# Altium schematic sheet Sheet1.SchDoc
size A3
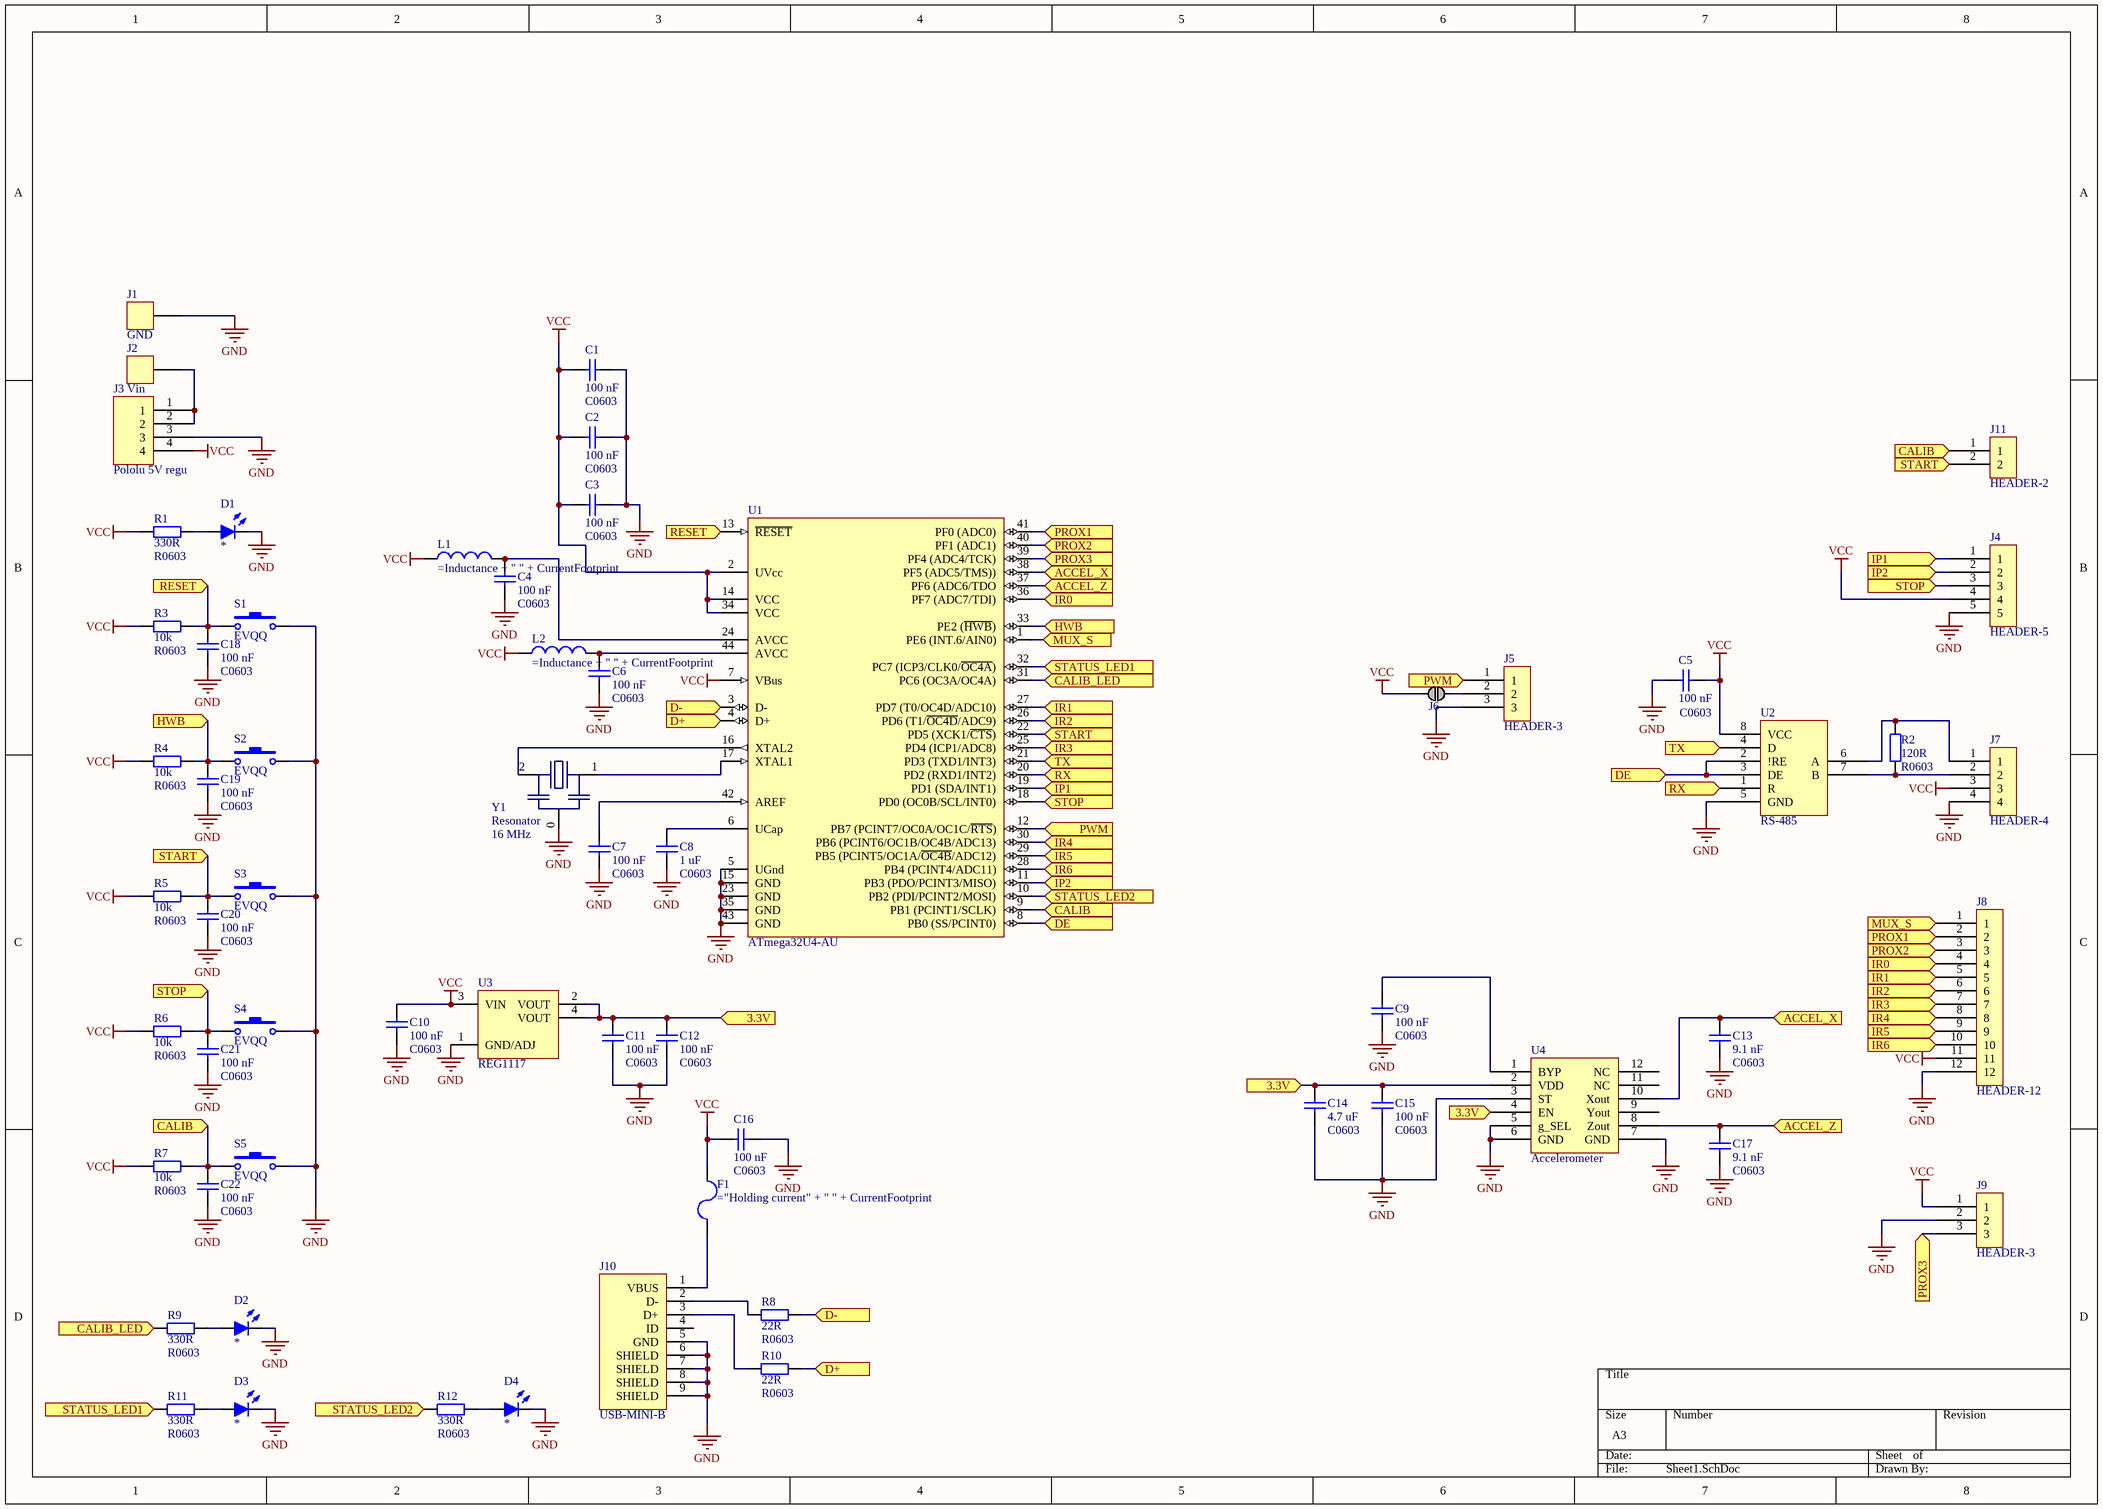
[diagram p0: Sheet1.SchDoc]

## Parts
C1  Capacitance: 100 nF  [C0603]
C2  Capacitance: 100 nF  [C0603]
C3  Capacitance: 100 nF  [C0603]
C4  Capacitance: 100 nF  [C0603]
C5  Capacitance: 100 nF  [C0603]
C6  Capacitance: 100 nF  [C0603]
C7  Capacitance: 100 nF  [C0603]
C8  Capacitance: 1 uF  [C0603]
C9  Capacitance: 100 nF  [C0603]
C10  Capacitance: 100 nF  [C0603]
C11  Capacitance: 100 nF  [C0603]
C12  Capacitance: 100 nF  [C0603]
C13  Capacitance: 9.1 nF  [C0603]
C14  Capacitance: 4.7 uF  [C0603]
C15  Capacitance: 100 nF  [C0603]
C16  Capacitance: 100 nF  [C0603]
C17  Capacitance: 9.1 nF  [C0603]
C18  Capacitance: 100 nF  [C0603]
C19  Capacitance: 100 nF  [C0603]
C20  Capacitance: 100 nF  [C0603]
C21  Capacitance: 100 nF  [C0603]
C22  Capacitance: 100 nF  [C0603]
D1  LED  [LED_0603]  (value not drawn)
D2  LED  [LED_0603]  (value not drawn)
D3  LED  [LED_0603]  (value not drawn)
D4  LED  [LED_0603]  (value not drawn)
F1  (no value)  [F1210]
J1  GND  [POWER-PAD-4x3]
J2  Vin  [POWER-PAD-4x3]
J3  Pololu 5V regu
J4  HEADER-5  [PIN-HEADER-5]
J5  HEADER-3  [PIN-HEADER-3]
J6  JUMPER  [JUMPER-SMD-1010]  (value not drawn)
J7  HEADER-4  [MICRO-MATCH-4]
J8  HEADER-12  [MICRO-MATCH-12]
J9  HEADER-3  [PIN-HEADER-3]
J10  USB-MINI-B  [USB-B-MINI]
J11  HEADER-2  [PIN-HEADER-2]
L1  Inductor  [L0805]  (value not drawn)
L2  Inductor  [L0805]  (value not drawn)
R1  330R  [R0603]
R2  120R  [R0603]
R3  10k  [R0603]
R4  10k  [R0603]
R5  10k  [R0603]
R6  10k  [R0603]
R7  10k  [R0603]
R8  22R  [R0603]
R9  330R  [R0603]
R10  22R  [R0603]
R11  330R  [R0603]
R12  330R  [R0603]
S1  EVQQ  [EVQQ]
S2  EVQQ  [EVQQ]
S3  EVQQ  [EVQQ]
S4  EVQQ  [EVQQ]
S5  EVQQ  [EVQQ]
U1  ATmega32U4-AU  [TQFP-44_10X10]
U2  RS-485  [RS-485]
U3  REG1117  [SOT-223]
U4  Accelerometer  [Accel]
Y1  Resonator  Frequency: 16 MHz  [Ceramic Resonator]

## Ports
3.3V, ACCEL_X, ACCEL_Z, CALIB, CALIB (in), CALIB_LED, D+, D-, DE, HWB, HWB (in), IP1, IP2, IR0, IR1, IR2, IR3, IR4, IR5, IR6, MUX_S, PROX1, PROX2, PROX3, PWM, RESET, RX, START, START (in), STATUS_LED1, STATUS_LED2, STOP, STOP (in), TX

## Nets
GND: C1.1 C2.1 C3.1 C4.1 C5.2 C6.1 C7.2 C8.2 C9.2 C10.1 C11.2 C12.2 C13.2 C14.1 C15.1 C16.1 C17.2 C18.2 C19.2 C20.2 C21.2 C22.2 D1.2(K) D2.2(K) D3.2(K) D4.2(K) J1.1 J3.3 J4.5 J5.3 J7.4 J8.12 J9.2 J10.5(GND) J10.6(SHIELD) J10.7(SHIELD) J10.8(SHIELD) J10.9(SHIELD) S1.2 S2.2 S3.2 S4.2 S5.2 U1.5(UGnd) U1.15(GND) U1.23(GND) U1.35(GND) U1.43(GND) U2.5(GND) U3.1(GND/ADJ) U4.3(ST) U4.5(g_SEL) U4.6(GND) U4.7(GND) Y1.0(GND)
VCC: C1.2 C2.2 C3.2 C5.1 C10.2 C16.2 F1.2 J3.4 J4.4 J6.1 J7.3 J8.11 J9.1 L1.1 L2.1 R1.2 R3.2 R4.2 R5.2 R6.2 R7.2 U1.2(UVcc) U1.7(VBus) U1.14(VCC) U1.34(VCC) U2.8(VCC) U3.3(VIN)
3.3V: C11.1 C12.1 C14.2 C15.2 U3.2(VOUT) U3.4(VOUT) U4.2(VDD) U4.4(EN) ; port 3.3V
ACCEL_X: C13.1 U1.38(PF5_(ADC5/TMS))) U4.10(Xout) ; port ACCEL_X
ACCEL_Z: C17.1 U1.37(PF6_(ADC6/TDO) U4.8(Zout) ; port ACCEL_Z
CALIB: C22.1 J11.1 R7.1 S5.1 U1.9(PB1_(PCINT1/SCLK)) ; port CALIB
CALIB_LED: R9.2 U1.31(PC6_(OC3A/OC4A)) ; port CALIB_LED
D+: R10.1 U1.4(D+) ; port D+
D-: R8.1 U1.3(D-) ; port D-
DE: U1.8(PB0_(SS/PCINT0)) U2.2(!RE) U2.3(DE) ; port DE
HWB: C19.1 R4.1 S2.1 U1.33(PE2_(~{HWB})) ; port HWB
IP1: J4.1 U1.19(PD1_(SDA/INT1)) ; port IP1
IP2: J4.2 U1.11(PB3_(PDO/PCINT3/MISO)) ; port IP2
IR0: J8.4 U1.36(PF7_(ADC7/TDI)) ; port IR0
IR1: J8.5 U1.27(PD7_(T0/OC4D/ADC10)) ; port IR1
IR2: J8.6 U1.26(PD6_(T1/~{OC4D}/ADC9)) ; port IR2
IR3: J8.7 U1.25(PD4_(ICP1/ADC8)) ; port IR3
IR4: J8.8 U1.30(PB6_(PCINT6/OC1B/OC4B/ADC13)) ; port IR4
IR5: J8.9 U1.29(PB5_(PCINT5/OC1A/~{OC4B}/ADC12)) ; port IR5
IR6: J8.10 U1.28(PB4_(PCINT4/ADC11)) ; port IR6
MUX_S: J8.1 U1.1(PE6_(INT.6/AIN0)) ; port MUX_S
PROX1: J8.2 U1.41(PF0_(ADC0)) ; port PROX1
PROX2: J8.3 U1.40(PF1_(ADC1)) ; port PROX2
PROX3: J9.3 U1.39(PF4_(ADC4/TCK)) ; port PROX3
PWM: J5.1 U1.12(PB7_(PCINT7/OC0A/OC1C/~{RTS})) ; port PWM
RESET: C18.1 R3.1 S1.1 U1.13(~{RESET}) ; port RESET
RX: U1.20(PD2_(RXD1/INT2)) U2.1(R) ; port RX
START: C20.1 J11.2 R5.1 S3.1 U1.22(PD5_(XCK1/~{CTS})) ; port START
STATUS_LED1: R11.2 U1.32(PC7_(ICP3/CLK0/~{OC4A})) ; port STATUS_LED1
STATUS_LED2: R12.2 U1.10(PB2_(PDI/PCINT2/MOSI)) ; port STATUS_LED2
STOP: C21.1 J4.3 R6.1 S4.1 U1.18(PD0_(OC0B/SCL/INT0)) ; port STOP
TX: U1.21(PD3_(TXD1/INT3)) U2.4(D) ; port TX
NetC4_2: C4.2 L1.2 U1.24(AVCC)
NetC6_2: C6.2 L2.2 U1.44(AVCC)
NetC7_1: C7.1 U1.42(AREF)
NetC8_1: C8.1 U1.6(UCap)
NetC9_1: C9.1 U4.1(BYP)
NetD1_1: D1.1(A) R1.1
NetD2_1: D2.1(A) R9.1
NetD3_1: D3.1(A) R11.1
NetD4_1: D4.1(A) R12.1
NetF1_1: F1.1 J10.1(VBUS)
NetJ2_1: J2.1 J3.1 J3.2
NetJ5_2: J5.2 J6.2
NetJ7_1: J7.1 R2.1 U2.6(A)
NetJ7_2: J7.2 R2.2 U2.7(B)
NetJ10_2: J10.2(D-) R8.2
NetJ10_3: J10.3(D+) R10.2
NetU1_16: U1.16(XTAL2) Y1.2
NetU1_17: U1.17(XTAL1) Y1.1

Not connected (* = marked no-connect by the designer): J10 4(ID); U4 9(Yout) 11(NC) 12(NC)

## Library data of the parts
C1-C22 = Capacitor: Ceramic capacitor; Type: MLCC; Voltage rating: *V; ComponentLinknDescription: Datasheet; Characteristic: *; Manufacturer: *; ComponentLinknURL: *; Note: C0603
D1-D4 = LED: Light Emitting Diode; ComponentLinknDescription: Datasheet; Space heritage: false; Current rating: *mA; Power dissipation: false; Drawn by: *; Colour: *
F1 = Fuse: Operating voltage: *V; Initial resistance: *R; Carrying current: *A; ComponentLinknDescription: Datasheet; Type: *; Manufacturer: *; Tripping current: *A; Holding current: *A; ComponentLinknURL: *; Comment_1: *; Note: ="Holding current" + " " + CurrentFootprint
J1 J2 = HEADER-1
J3 = Pin header 4
J6 = JUMPER-SMD
J10 = USB-B-MINI
L1 L2 = Inductor: Saturation current: *A; Inductance: 10 uH; DC resistance: *R; Self resonant frequency: *Hz; ComponentLinknDescription: Datasheet; Core material: *; RMS current: *A; Construction: *; ComponentLinknURL: *; Manufacturer: *; Note: =Inductance + " " + CurrentFootprint
R1-R12 = Resistor: Precision: *%; Voltage rating: *V; Temp coefficient: *ppm; Power rating: *mW; ComponentLinknDescription: Datasheet; Manufacturer: *; ComponentLinknURL: *; Note: R0603
  R1 R9 R11 R12: Resistance: 330R
  R2: Resistance: 120R
  R3-R7: Resistance: 10k
  R8 R10: Resistance: 22R
S1-S5 = EVQQ: Switch; Manufacturer: Panasonic; ComponentLinknDescription: Datasheet; Space heritage: false; Drawn by: Erik Ilbis; Verified: false; Part number: EVQQ
U1 = ATMEGA32U4-AU: 8-bit AVR Microcontroller, 2.7-5.5V, 32KB Flash, 2.5KB EEPROM, 1KB SRAM, USB Controller, 44-pin TQFP, Industrial Grade (-40°C to 85°C); Manufacturer: Atmel; ComponentLinknDescription: Datasheet; Space heritage: false; Drawn by: Erik Ilbis; Part number: ATMEGA32U4-AU; Verified: false
U3 = REG1117: ComponentLinknDescription: Datasheet; Space heritage: false; Manufacturer: *; Part number: REG1117; Verified: false; ComponentLinknURL: *; Drawn by: Erik Ilbis